# EAGLE schematic schematics (EAGLE 7.2.0)
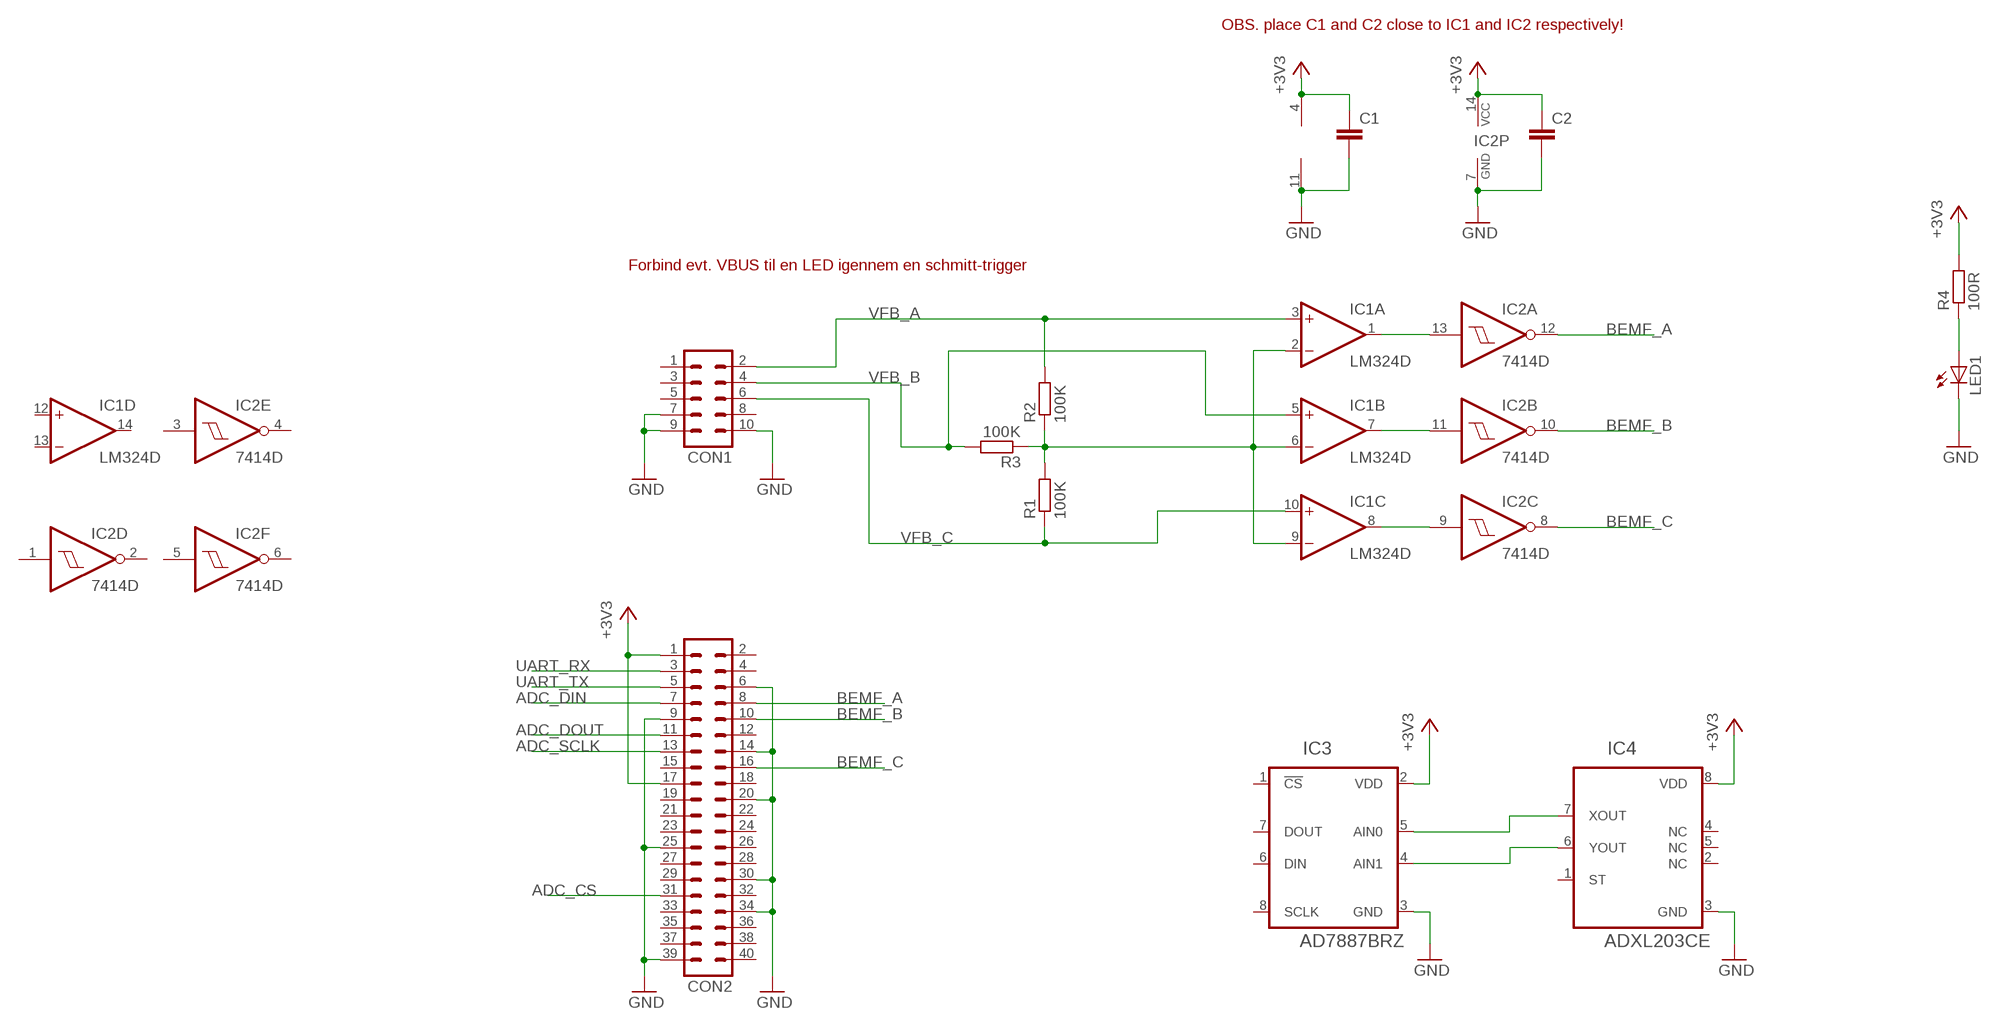
[diagram p0: schematic, sheet 1]

## Parts
C1  C-EUC0805K  [C0805K]
C2  C-EUC0805K  [C0805K]
CON1  MA05-2  [MA05-2]
CON2  MA20-2  [MA20-2]
IC1  LM324D  [SO14]
IC2  7414D  [SO14]
IC3  AD7887BRZ  [SO08]
IC4  ADXL203CE  [LCC127P500X500X220-8N]
LED1  LEDCHIP-LED0805  [CHIP-LED0805]
R1  100K  R-EU_R0805  [R0805]
R2  100K  R-EU_R0805  [R0805]
R3  100K  R-EU_R0805  [R0805]
R4  100R  R-EU_R0805  [R0805]

## Nets
+3V3: C1.1 C2.1 CON2.1 CON2.17 IC1.4(P:V+) IC2.14(P:VCC) IC3.2(VDD) IC4.8(VDD) R4.2
ADC_CS: CON2.31
ADC_DIN: CON2.7
ADC_DOUT: CON2.11
ADC_SCLK: CON2.13
BEMF_A: CON2.8 IC2.12(A:O)
BEMF_B: CON2.10 IC2.10(B:O)
BEMF_C: CON2.16 IC2.8(C:O)
GND: C1.2 C2.2 CON1.7 CON1.9 CON1.10 CON2.6 CON2.9 CON2.14 CON2.20 CON2.25 CON2.30 CON2.34 CON2.39 IC1.11(P:V-) IC2.7(P:GND) IC3.3(GND) IC4.3(GND) LED1.C
N$1: IC1.1(A:OUT) IC2.13(A:I)
N$2: IC1.7(B:OUT) IC2.11(B:I)
N$3: IC1.8(C:OUT) IC2.9(C:I)
N$4: IC1.2(A:-IN) IC1.6(B:-IN) IC1.9(C:-IN) R1.2 R2.1 R3.1
N$5: IC3.5(AIN0) IC4.7(XOUT)
N$6: IC3.4(AIN1) IC4.6(YOUT)
N$7: LED1.A R4.1
UART_RX: CON2.3
UART_TX: CON2.5
VFB_A: CON1.2 IC1.3(A:+IN) R2.2
VFB_B: CON1.4 IC1.5(B:+IN) R3.2
VFB_C: CON1.6 IC1.10(C:+IN) R1.1
Unconnected: CON1.1 CON1.3 CON1.5 CON1.8 CON2.2 CON2.4 CON2.12 CON2.15 CON2.18 CON2.19 CON2.21 CON2.22 CON2.23 CON2.24 CON2.26 CON2.27 CON2.28 CON2.29 CON2.32 CON2.33 CON2.35 CON2.36 CON2.37 CON2.38 CON2.40 IC1.12(D:+IN) IC1.13(D:-IN) IC1.14(D:OUT) IC2.1(D:I) IC2.2(D:O) IC2.3(E:I) IC2.4(E:O) IC2.5(F:I) IC2.6(F:O) IC3.1(!CS) IC3.6(DIN) IC3.7(DOUT) IC3.8(SCLK) IC4.1(ST) IC4.2(NC) IC4.4(NC) IC4.5(NC)

## Notes on the sheet
- OBS. place C1 and C2 close to IC1 and IC2 respectively!
- Forbind evt. VBUS til en LED igennem en schmitt-trigger

## Library data of the parts
C1 C2 = rcl:C-EU: CAPACITOR, European symbol
CON1 = con-lstb:MA05-2: PIN HEADER; OC_FARNELL: unknown; OC_NEWARK: unknown
CON2 = con-lstb:MA20-2: PIN HEADER; OC_FARNELL: unknown; OC_NEWARK: unknown
IC1 = linear:LM324: OP AMP
IC2 = 74xx-eu:74*14: Hex schmitt trigger INVERTER
IC3 = tobylib:AD7887BRZ: AD7887: 2-channel 125Ksps 12bit ADC Datasheet <http://www.analog.com/media/en/technical-documentation/data-sheets/AD7887.pdf>
IC4 = tobylib:ADXL203CE: 2-axis Accelerometer ADXL203 Datasheet <http://www.analog.com/media/en/technical-documentation/data-sheets/ADXL103_203.pdf>; AVAILABILITY: Good; DESCRIPTION: Accelerometer Dual ±1.7g 3V to 6V 960mV/g to 1040mV/g 8-Pin CLCC T/R; MF: Analog Devices; MP: ADXL203CE-REEL; PACKAGE: CLCC-8 Analog Devices; PRICE: 19.20 USD
LED1 = led:LED: LED OSRAM: - CHIPLED LG R971, LG N971, LY N971, LG Q971, LY Q971, LO R971, LY R971 LH N974, LH R974 LS Q976, LO Q976, LY Q976 LO Q996 - Hyper CHIPLED LW Q18S LB Q993, LB Q99A, LB R99A - SideLED LS A670, LO A670, LY A670, LG A670, LP A670 LB A673, LV A673, LT A673, LW A673 LH A674 LY A675 LS A676, LA A676, LO A676, LY A676, LW A676 LS A679, LY A679, LG A679 - Hyper Micro SIDELED® LS Y876, LA Y876, LO Y876, LY Y876 LT Y87S - SmartLED LW L88C, LW L88S LB L89C, LB L89S, LG L890 LS L89K, LO L89K, LY L89K LS L896, LA L896, LO L896, LY L896 - TOPLED LS T670, LO T670, LY T670, LG T670, LP T670 LSG T670, LSP T670, LSY T670, LOP T670, LYG T670 LG T671, LOG T671, LSG T671 LB T673, LV T673, LT T673, LW T673 LH T674 LS T676, LA T676, LO T676, LY T676, LB T676, LH T676, LSB T676, LW T676 LB T67C, LV T67C, LT T67C, LS T67K, LO T67K, LY T67K, LW E67C LS E67B, LA E67B, LO E67B, LY E67B, LB E67C, LV E67C, LT E67C LW T67C LS T679, LY T679, LG T679 LS T770, LO T770, LY T770, LG T770, LP T770 LB T773, LV T773, LT T773, LW T773 LH T774 LS E675, LA E675, LY E675, LS T675 LS T776, LA T776, LO T776, LY T776, LB T776 LHGB T686 LT T68C, LB T68C - Hyper Mini TOPLED® LB M676 - Mini TOPLED Santana® LG M470 LS M47K, LO M47K, LY M47K Source: http://www.osram.convergy.de LUXEON: - LUMILED® LXK2-PW12-R00, LXK2-PW12-S00, LXK2-PW14-U00, LXK2-PW14-V00 LXK2-PM12-R00, LXK2-PM12-S00, LXK2-PM14-U00 LXK2-PE12-Q00, LXK2-PE12-R00, LXK2-PE12-S00, LXK2-PE14-T00, LXK2-PE14-U00 LXK2-PB12-K00, LXK2-PB12-L00, LXK2-PB12-M00, LXK2-PB14-N00, LXK2-PB14-P00, LXK2-PB14-Q00 LXK2-PR12-L00, LXK2-PR12-M00, LXK2-PR14-Q00, LXK2-PR14-R00 LXK2-PD12-Q00, LXK2-PD12-R00, LXK2-PD12-S00 LXK2-PH12-R00, LXK2-PH12-S00 LXK2-PL12-P00, LXK2-PL12-Q00, LXK2-PL12-R00 Source: www.luxeon.com KINGBRIGHT: KA-3528ASYC Source: www.kingbright.com
R1-R4 = rcl:R-EU_: RESISTOR, European symbol